# EAGLE design PhatStats Slim Enclosure ESP Lolin D32 XTP2046 PCB v1.0  (EAGLE 7.6.0)
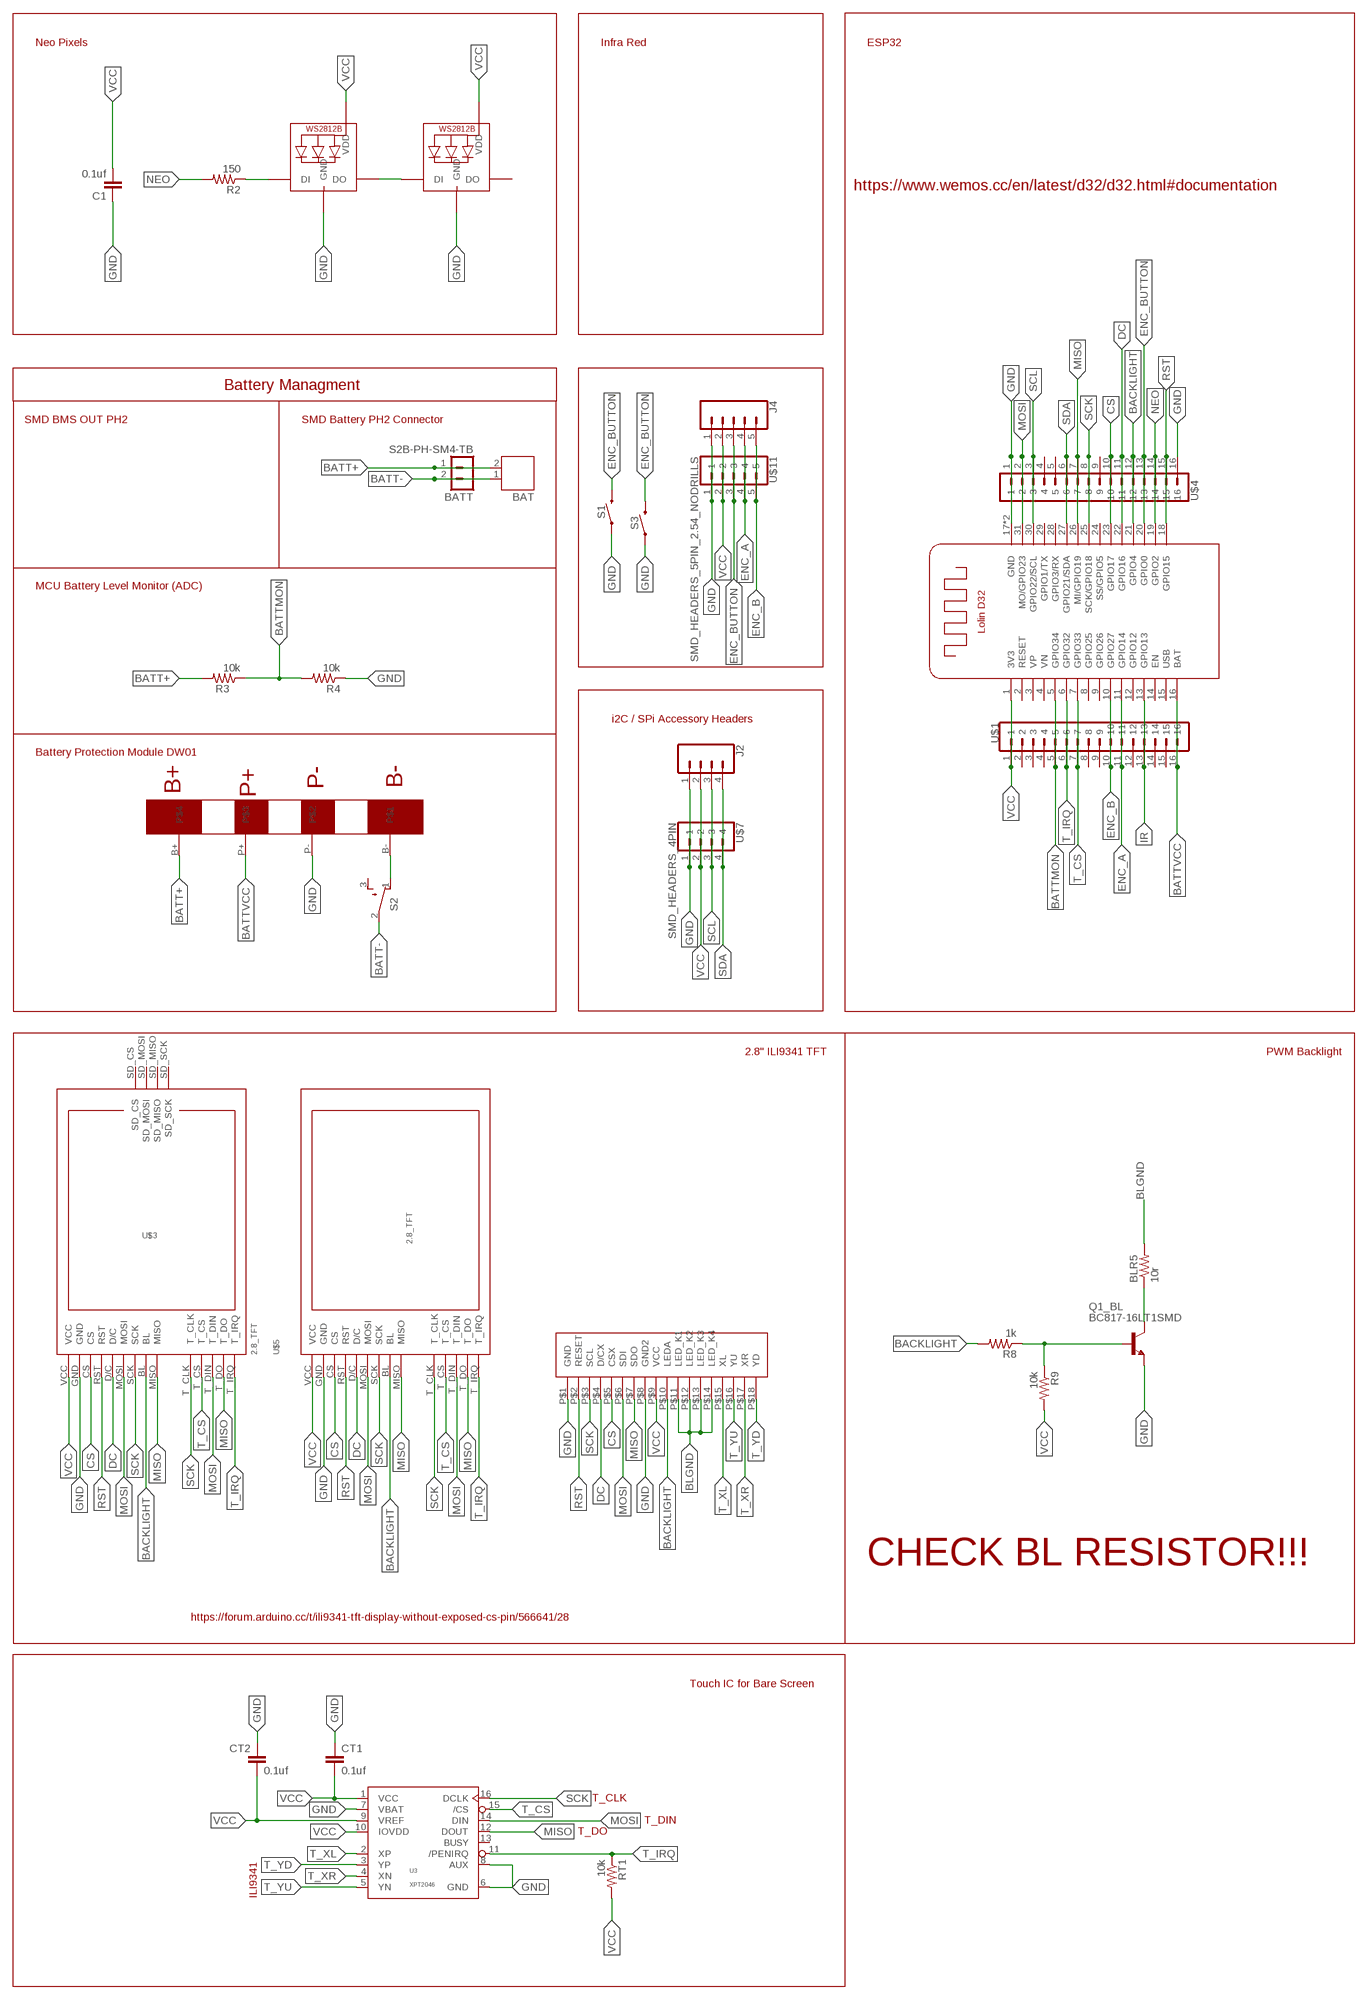
[diagram p0: schematic, sheet 1]

## Parts
0  ILI9341-2.8  [ILI9341-2.8]
BAT  JST-PH2  [JST-PH2]
BATT  S2B-PH-SM4-TB  [S2B-PH-SM4-TB]
BLR5  10r  R-US_M1206  [M1206]
BMS  DW01BATTERYPROT  [DW01BATTERYPROT]
C1  0.1uf  C-EUC1206  [C1206]
CT1  0.1uf  C-EUC1206  [C1206]
CT2  0.1uf  C-EUC1206  [C1206]
J2  CONN_04PTH  [1X04]
J4  CONN_05  [1X05]
NEO1  WS2812B5050  [WS2812B]
NEO2  WS2812B5050  [WS2812B]
Q1_BL  BC817-16LT1SMD  [SOT23-BEC]
R2  150  R-US_M1206  [M1206]
R3  10k  R-US_M1206  [M1206]
R4  10k  R-US_M1206  [M1206]
R8  1k  R-US_M1206  [M1206]
R9  10k  R-US_M1206  [M1206]
RT1  10k  R-US_M1206  [M1206]
S1  MOMENTARY-SWITCH-SPST-PTH-6.0MM  [TACTILE_SWITCH_PTH_6.0MM]
S2  SK-12F14(1P2T)0.5A50VDC3MMPITCH  [SK-12F14(1P2T)0.5A50VDC3MMPITCH]
S3  MOMENTARY-SWITCH-SPST-SMD-6.2MM-TALL  [TACTILE_SWITCH_SMD_6.2MM_TALL]
U3  XPT2046  [TSSOP-16]
U$1  SMD_HEADERS_16PIN_2.54_NODRILLSSMD_HEADERS_16PIN  [SMD_HEADERS_16PIN]
U$2  TML_LOLIND32  [TML_LOLIND32]
U$3  2.8_TFT  [2.8_TFT]
U$4  SMD_HEADERS_16PIN_2.54_NODRILLSSMD_HEADERS_16PIN  [SMD_HEADERS_16PIN]
U$5  2.8_TFT  [2.8_TFT]
U$7  SMD_HEADERS_4PIN  [SMD_HEADERS_4PIN]
U$11  SMD_HEADERS_5PIN_2.54_NODRILLS  [SMD_HEADERS_5PIN]

## Nets
BACKLIGHT: 0.P$10(LEDA) R8.2 U$2.21(GPIO4) U$3.BL U$4.12 U$5.BL
BATT+: BAT.2 BATT.1 BMS.B+ R3.2
BATT-: BAT.1 BATT.2 S2.2(P)
BATTMON: R3.1 R4.2 U$1.5 U$2.5(GPIO34)
BATTVCC: BMS.P+ U$1.16 U$2.16(BAT)
BL: BLR5.1 Q1_BL.C
BLGND: 0.P$11(LED_K1) 0.P$12(LED_K2) 0.P$13(LED_K3) 0.P$14(LED_K4) BLR5.2
CS: 0.P$5(CSX) U$2.23(GPIO17) U$3.CS U$4.10 U$5.CS
DC: 0.P$4(D/CX) U$2.22(GPIO16) U$3.D/C U$4.11 U$5.D/C
ENC_A: J4.4 U$1.11 U$2.11(GPIO14) U$11.4
ENC_B: J4.5 U$1.10 U$2.10(GPIO27) U$11.5
ENC_BUTTON: J4.3 S1.3 S3.B2 U$2.20(GPIO0) U$4.13 U$11.3
GND: 0.P$1(GND) 0.P$8(GND2) BMS.P- C1.1 CT1.1 CT2.1 J2.1 J4.1 NEO1.3-GND(GND) NEO2.3-GND(GND) Q1_BL.E R4.1 S1.1 S3.A2 U3.6(GND) U3.7(VBAT) U3.8(AUX) U$2.17(GND) U$2.32(GND) U$3.GND U$4.1 U$4.16 U$5.GND U$7.1 U$11.1
IR: U$1.13 U$2.13(GPIO13)
MISO: 0.P$7(SDO) U3.12(DOUT) U$2.26(MI/GPIO19) U$3.MISO U$3.T_DO U$4.7 U$5.MISO U$5.T_DO
MOSI: 0.P$6(SDI) U3.14(DIN) U$2.31(MO/GPIO23) U$3.MOSI U$3.T_DIN U$4.2 U$5.MOSI U$5.T_DIN
N$1: BMS.B- S2.1(O)
N$2: NEO1.2-DOUT(DO) NEO2.4-DIN(DI)
N$4: NEO1.4-DIN(DI) R2.1
N$7: Q1_BL.B R8.1 R9.1
NEO: R2.2 U$2.19(GPIO2) U$4.14
RST: 0.P$2(RESET) U$2.18(GPIO15) U$3.RST U$4.15 U$5.RST
SCK: 0.P$3(SCL) U3.16(DCLK) U$2.25(SCK/GPIO18) U$3.SCK U$3.T_CLK U$4.8 U$5.SCK U$5.T_CLK
SCL: J2.3 U$2.30(GPIO22/SCL) U$4.3 U$7.3
SDA: J2.4 U$2.27(GPIO21/SDA) U$4.6 U$7.4
T_CS: U3.15(/CS) U$1.7 U$2.7(GPIO33) U$3.T_CS U$5.T_CS
T_IRQ: RT1.1 U3.11(/PENIRQ) U$1.6 U$2.6(GPIO32) U$3.T_IRQ U$5.T_IRQ
T_XL: 0.P$15(XL) U3.2(XP)
T_XR: 0.P$17(XR) U3.4(XN)
T_YD: 0.P$18(YD) U3.3(YP)
T_YU: 0.P$16(YU) U3.5(YN)
VCC: 0.P$9(VCC) C1.2 CT1.2 CT2.2 J2.2 J4.2 NEO1.1-VDD(VDD) NEO2.1-VDD(VDD) R9.2 RT1.2 U3.1(VCC) U3.9(VREF) U3.10(IOVDD) U$1.1 U$2.1(3V3) U$3.VCC U$5.VCC U$7.2 U$11.2
Unconnected: NEO2.2-DOUT(DO) S2.3(S) U3.13(BUSY) U$1.2 U$1.3 U$1.4 U$1.8 U$1.9 U$1.12 U$1.14 U$1.15 U$2.2(RESET) U$2.3(VP) U$2.4(VN) U$2.8(GPIO25) U$2.9(GPIO26) U$2.12(GPIO12) U$2.14(EN) U$2.24(SS/GPIO5) U$2.28(GPIO3/RX) U$2.29(GPIO1/TX) U$3.SD_CS U$3.SD_MISO U$3.SD_MOSI U$3.SD_SCK U$4.4 U$4.5 U$4.9

## Notes on the sheet
- Neo Pixels | Infra Red | ESP32
- https://www.wemos.cc/en/latest/d32/d32.html#documentation
- Battery Managment
- SMD BMS OUT PH2 | SMD Battery PH2 Connector
- MCU Battery Level Monitor (ADC)
- i2C / SPi Accessory Headers
- Battery Protection Module DW01
- 2.8" ILI9341 TFT | PWM Backlight
- CHECK BL RESISTOR!!!
- https://forum.arduino.cc/t/ili9341-tft-display-without-exposed-cs-pin/566641/28
- Touch IC for Bare Screen
- T_CLK
- T_DIN
- T_DO
- ILI9341

## Power pins joined to a net without a drawn wire
USB: U$2.15(USB)

## Library data of the parts
0 = TML_ili9341_0.8Pitch_Header:ILI9341-2.8
BAT = jst-ph:JST-PH2
BATT = con-JST PH:S2B-PH: JST PH series header 2.00mm pitch disconnectable crimp style connectors, horizontal (side entry type), 2 pins
BLR5 R2-R4 R8 R9 RT1 = resistor:R-US_: RESISTOR, American symbol
BMS = TML_DW01_BatteryProtectionModule2:DW01BATTERYPROT
C1 CT1 CT2 = rcl:C-EU: CAPACITOR, European symbol
J2 = SparkFun-Connectors:CONN_04: Multi connection point. Often used as Generic Header-pin footprint for 0.1 inch spaced/style header connections On any of the 0.1 inch spaced packages, you can populate with these: Break Away Headers - Straight <https://www.sparkfun.com/products/116> (PRT-00116) Break Away Male Headers - Right Angle <https://www.sparkfun.com/products/553> (PRT-00553) Female Headers <https://www.sparkfun.com/products/115> (PRT-00115) Break Away Headers - Machine Pin <https://www.sparkfun.com/products/117> (PRT-00117) Break Away Female Headers - Swiss Machine Pin <https://www.sparkfun.com/products/743> (PRT-00743) For SCREWTERMINALS and SPRING TERMINALS visit here: Screw Terimnals on SparkFun.com <https://www.sparkfun.com/search/results?term=Screw+Terminals> (5mm/3.5mm/2.54mm spacing) This device is also useful as a general connection point to wire up your design to another part of your project. Our various solder wires solder well into these plated through hole pads. Hook-Up Wire - Assortment (Stranded, 22 AWG) <https://www.sparkfun.com/products/11375> (PRT-11375) Hook-Up Wire - Assortment (Solid Core, 22 AWG) <https://www.sparkfun.com/products/11367> (PRT-11367) View the entire wire category on our website here <https://www.sparkfun.com/categories/141> Special notes: Molex polarized connector foot print use with SKU : PRT-08231 with associated crimp pins and housings. 1MM SMD Version SKU: PRT-10208; PROD_ID: CONN-09696
J4 = SparkFun-Connectors:CONN_05: Multi connection point. Often used as Generic Header-pin footprint for 0.1 inch spaced/style header connections On any of the 0.1 inch spaced packages, you can populate with these: Break Away Headers - Straight <https://www.sparkfun.com/products/116> (PRT-00116) Break Away Male Headers - Right Angle <https://www.sparkfun.com/products/553> (PRT-00553) Female Headers <https://www.sparkfun.com/products/115> (PRT-00115) Break Away Headers - Machine Pin <https://www.sparkfun.com/products/117> (PRT-00117) Break Away Female Headers - Swiss Machine Pin <https://www.sparkfun.com/products/743> (PRT-00743) For SCREWTERMINALS and SPRING TERMINALS visit here: Screw Terimnals on SparkFun.com <https://www.sparkfun.com/search/results?term=Screw+Terminals> (5mm/3.5mm/2.54mm spacing) This device is also useful as a general connection point to wire up your design to another part of your project. Our various solder wires solder well into these plated through hole pads. Hook-Up Wire - Assortment (Stranded, 22 AWG) <https://www.sparkfun.com/products/11375> (PRT-11375) Hook-Up Wire - Assortment (Solid Core, 22 AWG) <https://www.sparkfun.com/products/11367> (PRT-11367) View the entire wire category on our website here <https://www.sparkfun.com/categories/141> Special notes: Molex polarized connector foot print use with SKU : PRT-08231 with associated crimp pins and housings. 1MM SMD Version SKU: PRT-10208
NEO1 NEO2 = adafruit:WS2812B
Q1_BL = transistor-npn:BC817*: NPN Transistor
S1 = SparkFun-Switches:MOMENTARY-SWITCH-SPST: Momentary Switch (Pushbutton) - SPST Normally-open (NO) SPST momentary switches (buttons, pushbuttons). Variants PTH-12MM - 12mm square, through-hole Momentary Pushbutton Switch - 12mm Square <https://www.sparkfun.com/products/9190> (COM-09190) PTH-6.0MM, PTH-6.0MM-KIT - 6.0mm square, through-hole Mini Pushbutton Switch <https://www.sparkfun.com/products/97> (COM-00097) KIT package intended for soldering kit's - only one side of pads' copper is exposed. PTH-RIGHT-ANGLE-KIT - Right-angle, through-hole Right Angle Tactile Button <https://www.sparkfun.com/products/10791> - Used on SparkFun BigTime Watch Kit <https://www.sparkfun.com/products/11734> SMD-12MM - 12mm square, surface-mount Tactile Button - SMD (12mm) <https://www.sparkfun.com/products/12993> (COM-12993) Used on SparkFun PicoBoard <https://www.sparkfun.com/products/11888> SMD-4.5MM - 4.5mm Square Trackball Switch Used on SparkFun Blackberry Trackballer Breakout <https://www.sparkfun.com/products/13169> SMD-4.6MMX2.8MM - 4.60mm x 2.80mm, surface mount Used on SparkFun SAMD21 Mini Breakout <https://www.sparkfun.com/products/13664> SMD-5.2MM, SMD-5.2-REDUNDANT - 5.2mm square, surface-mount Mini Pushbutton Switch - SMD <https://www.sparkfun.com/products/8720> (COM-08720) Used on Arduino Pro Mini <https://www.sparkfun.com/products/11114> REDUNDANT package connects both switch circuits together SMD-6.0X3.5MM - 6.0 x 3.5mm, surface mount Momentary Reset Switch SMD <https://www.sparkfun.com/products/8229> (COM-08229) SMD-6.2MM-TALL - 6.2mm square, surface mount Tactile Button - SMD (6mm) <https://www.sparkfun.com/products/12992> Used on SparkFun Digital Sandbox <https://www.sparkfun.com/products/12651> SMD-RIGHT-ANGLE - Right-angle, surface mount Used on SparkFun Block for Intel® Edison - Arduino <https://www.sparkfun.com/products/13036>; PROD_ID: SWCH-08441; SF_SKU: COM-00097
S2 = TML_SK-12F14(1P2T)  90D 0.5a 50vdc 3mm pitch:SK-12F14(1P2T)0.5A50VDC3MMPITCH: SK-12F14(1P2T) 0.5a 50vdc 3mm pitch
S3 = SparkFun-Switches:MOMENTARY-SWITCH-SPST: Momentary Switch (Pushbutton) - SPST Normally-open (NO) SPST momentary switches (buttons, pushbuttons). Variants PTH-12MM - 12mm square, through-hole Momentary Pushbutton Switch - 12mm Square <https://www.sparkfun.com/products/9190> (COM-09190) PTH-6.0MM, PTH-6.0MM-KIT - 6.0mm square, through-hole Mini Pushbutton Switch <https://www.sparkfun.com/products/97> (COM-00097) KIT package intended for soldering kit's - only one side of pads' copper is exposed. PTH-RIGHT-ANGLE-KIT - Right-angle, through-hole Right Angle Tactile Button <https://www.sparkfun.com/products/10791> - Used on SparkFun BigTime Watch Kit <https://www.sparkfun.com/products/11734> SMD-12MM - 12mm square, surface-mount Tactile Button - SMD (12mm) <https://www.sparkfun.com/products/12993> (COM-12993) Used on SparkFun PicoBoard <https://www.sparkfun.com/products/11888> SMD-4.5MM - 4.5mm Square Trackball Switch Used on SparkFun Blackberry Trackballer Breakout <https://www.sparkfun.com/products/13169> SMD-4.6MMX2.8MM - 4.60mm x 2.80mm, surface mount Used on SparkFun SAMD21 Mini Breakout <https://www.sparkfun.com/products/13664> SMD-5.2MM, SMD-5.2-REDUNDANT - 5.2mm square, surface-mount Mini Pushbutton Switch - SMD <https://www.sparkfun.com/products/8720> (COM-08720) Used on Arduino Pro Mini <https://www.sparkfun.com/products/11114> REDUNDANT package connects both switch circuits together SMD-6.0X3.5MM - 6.0 x 3.5mm, surface mount Momentary Reset Switch SMD <https://www.sparkfun.com/products/8229> (COM-08229) SMD-6.2MM-TALL - 6.2mm square, surface mount Tactile Button - SMD (6mm) <https://www.sparkfun.com/products/12992> Used on SparkFun Digital Sandbox <https://www.sparkfun.com/products/12651> SMD-RIGHT-ANGLE - Right-angle, surface mount Used on SparkFun Block for Intel® Edison - Arduino <https://www.sparkfun.com/products/13036>; PROD_ID: SWCH-11966; SF_SKU: COM-12992
U3 = TML_XPT2046:XPT2046: XPT2046 touch screen controller General Description The XPT2046 is a 4-wire resistive touch screen controller that incorporates a 12-bit 125 kHz sampling SAR type A/D converter. The XPT2046 operates down to 2.2V supply voltage and supports digital I/O interface voltage from 1.5V to VCC in order to connect low voltage uP. The XPT2046 can detect the pressed screen location by performing two A/D conversions. In addition to location, the XPT2046 also measures touch screen pressure.On-chip VREF can be utilized for analog auxiliary input, temperature measurement and battery monitoring withthe ability to measure voltage from 0V to 5V. The XPT2046 also has an on-chip temperature sensor The XPT2046 is available in 16pin QFN thin package(0.75mm in height) and has the operating temperature range of -40°C to +85°C Features 12 bit SAR type A/D converter with S/H circuit Low voltage operation (VCC = 2.2V ∼ 3.6V) Low voltage digital I/F (1.5V ∼ VCC) 4-wire I/F Sampling frequency: 125 kHz (max) On-Chip voltage reference (2.5V) Pen pressure measurement On-chip thermo sensor Direct battery masurement Low power consumption (260μA) Package 16pin QFN Check prices <https://pricing.snapeda.com/parts/XPT2046/Xptek/view-part?ref=eda>; AVAILABILITY: Not in stock; DESCRIPTION: RASPBERRY PI 3.5 TFT DISPLAY; MF: Xptek; MP: XPT2046; PACKAGE: Package; PRICE: None
U$1 U$4 = TML_SMD_Headers_2.54_NoDrill:SMD_HEADERS_16PIN_2.54_NODRILLS
U$2 = TML_Wemos Lolin D32 ESP32 Round Corrected:TML_LOLIND32: Wemos Lolin D32 Lolin D32 is a development board based on ESP32. On this schematic, this board is designed with battery port. Pins VP and VN are Not Connected pins.
U$3 = TML_ili9341-2.8_tft-display_Corrected:2.8_TFT: ILI9341 2.8" 2.8 inch TFT SPI Touch Panel 240X320 http://www.lcdwiki.com/2.8inch_SPI_Module_ILI9341_SKU:MSP2807 http://www.lcdwiki.com/Run_Arduino_Demo_in_spi_model
U$5 = TML_ili9341-2.8_tft-display_PinHeader only:2.8_TFT: ILI9341 2.8" 2.8 inch TFT SPI Touch Panel 240X320 http://www.lcdwiki.com/2.8inch_SPI_Module_ILI9341_SKU:MSP2807 http://www.lcdwiki.com/Run_Arduino_Demo_in_spi_model
U$7 = TML_SMD_Headers_2.54_NoDrill:SMD_HEADERS_4PIN
U$11 = TML_SMD_Headers_2.54_NoDrill:SMD_HEADERS_5PIN_2.54_NODRILLS

## Board
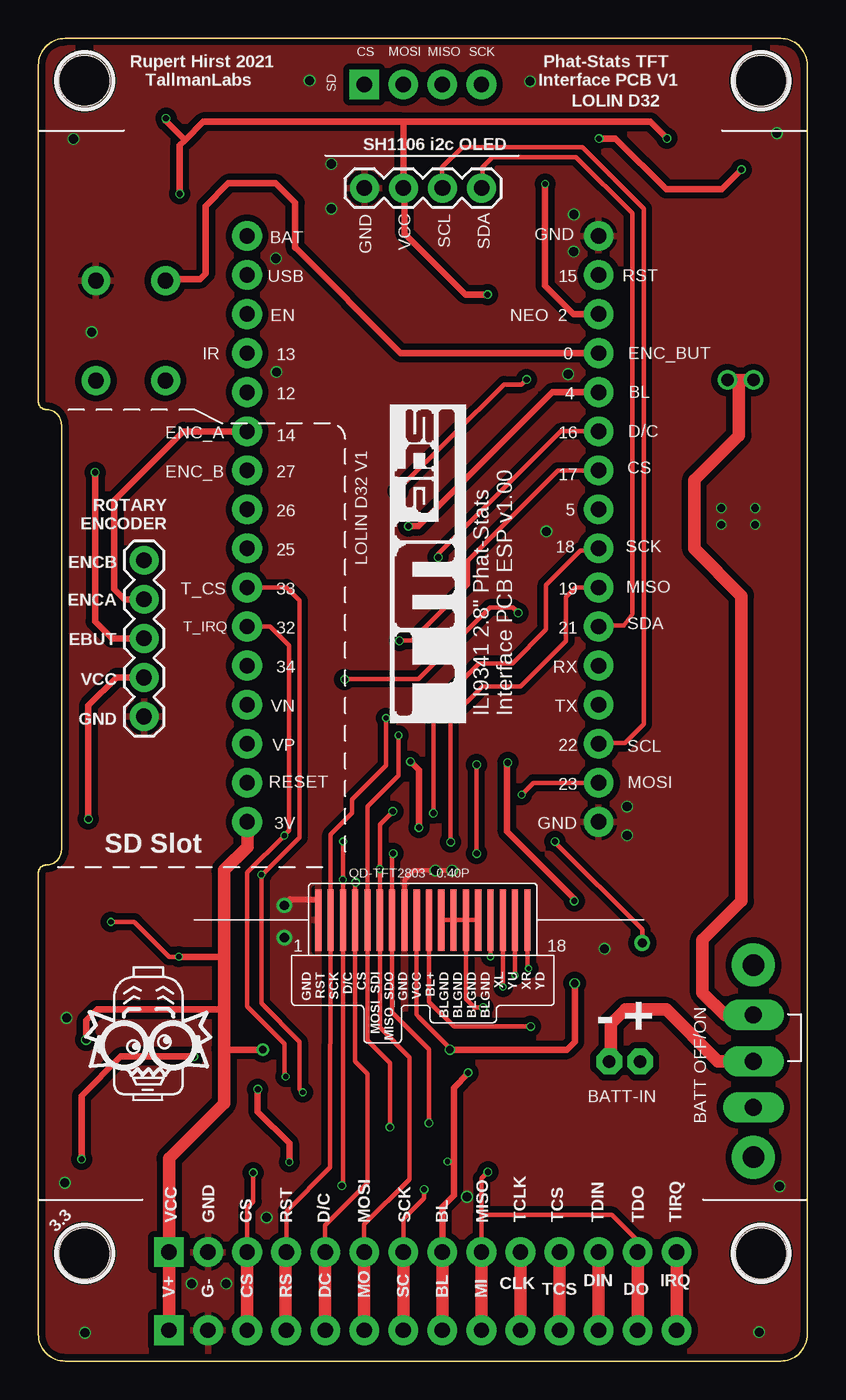
[diagram p1: board, top side]
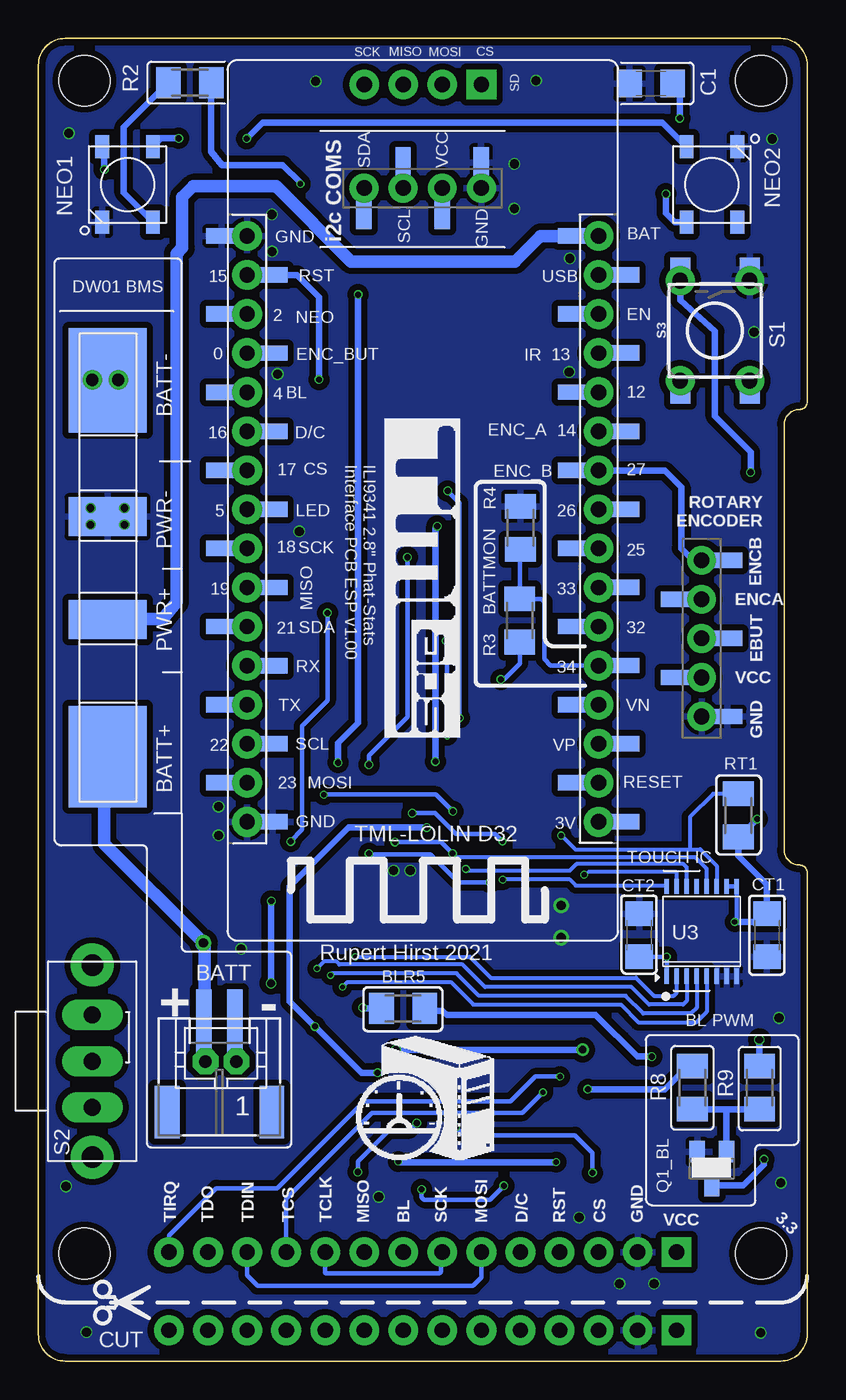
[diagram p2: board, bottom side, seen from below]

Size 50 x 86 mm. Coordinates in mm from the lower left corner, seen from the top.
Outline: 50,84.27 50,1.73 arc-90 48.27,0 1.73,0 arc-90 0,1.73 0,31.75 arc-90 0.5,32.25 arc90 1.5,33.25 1.5,60.88 arc90 0.5,61.88 arc-90 0,62.38 0,84.27 arc-90 1.73,86 48.27,86 arc-90 50,84.27
Copper layers (1*16): Top 0.035mm / dielectric 1.6mm / Bottom 0.035mm
Design rules "jlcpcb-2layers": minimum track width 5mil, minimum drill 0.3mm, track to track 5mil, track to pad 5mil, pad to pad 5mil, via to via 5mil, smd to smd 5mil, copper to edge 0.2mm, drill to drill 6mil, minimum pad ring 10mil, minimum via ring 3mil, stop-mask expansion 4mil, vias tented up to drill 0mil, thermal gap 10mil
Holes 3.3 mm at 3,83.25 47,83.25 47,7 3,7

### Footprints (pad centres in the part's own frame; a part is rotated, then mirrored left to right if it is on the bottom)
ILI9341-2.8 = smd 4 x 0.4: P$1 -18,6.8; P$2 -18,6; P$3 -18,5.2; P$4 -18,4.4; P$5 -18,3.6; P$6 -18,2.8; P$7 -18,2; P$8 -18,1.2; P$9 -18,0.4; P$10 -18,-0.4; P$11 -18,-1.2; P$12 -18,-2; P$13 -18,-2.8; P$14 -18,-3.6; P$15 -18,-4.4; P$16 -18,-5.2; P$17 -18,-6; P$18 -18,-6.8
JST-PH2 = drill 0.813 pad 1.676 octagon: 1 1,0; 2 -1,0
S2B-PH-SM4-TB = smd 1 x 4.5: 1 1,0; 2 -1,0 | smd 1.6 x 3.4: M1 3.4,5.75; M2 -3.4,5.75
M1206 = smd 1.6 x 2: 1 -1.4,0; 2 1.4,0
DW01BATTERYPROT = smd 5.08 x 2.54: B+ 3.175,29.15; B+1 3.175,26.745; B+2 3.175,6.405; B+3 3.175,30.805; B- 3.175,4.31; B-1 3.175,2.155; P+ 3.175,19.839; P- 3.175,13.154
C1206 = smd 1.6 x 1.8: 1 -1.4,0; 2 1.4,0
1X04 = drill 1.016 pad 1.88: 1 0,0; 2 2.54,0; 3 5.08,0; 4 7.62,0
1X05 = drill 1.016 pad 1.88: 1 0,0; 2 2.54,0; 3 5.08,0; 4 7.62,0; 5 10.16,0
WS2812B = smd 1.5 x 0.9: 1-VDD 2.45,-1.65; 2-DOUT 2.45,1.65; 3-GND -2.45,1.65; 4-DIN -2.45,-1.65
SOT23-BEC = smd 1 x 1.4: B -0.95,-1.1; C 0,1.1; E 0.95,-1.1
TACTILE_SWITCH_PTH_6.0MM = drill 1.016 pad 1.88: 1 -3.251,2.261; 2 3.251,2.261; 3 -3.251,-2.261; 4 3.251,-2.261
SK-12F14(1P2T)0.5A50VDC3MMPITCH = drill 1.1 pad 1.422 long: 1 -3,0; 2 0,0; 3 3,0 | drill 1.4 pad 2.8: M1 -6.25,0; M2 6.25,0
TACTILE_SWITCH_SMD_6.2MM_TALL = smd 1.55 x 1.3: A1 -3.975,-2.25; A2 3.975,-2.25; B1 -3.975,2.25; B2 3.975,2.25
TSSOP-16 = smd 0.305 x 0.991: 1 -2.275,-2.918; 2 -1.625,-2.918; 3 -0.975,-2.918; 4 -0.325,-2.918; 5 0.325,-2.918; 6 0.975,-2.918; 7 1.625,-2.918; 8 2.275,-2.918; 9 2.275,2.918; 10 1.625,2.918; 11 0.975,2.918; 12 0.325,2.918; 13 -0.325,2.918; 14 -0.975,2.918; 15 -1.625,2.918; 16 -2.275,2.918
SMD_HEADERS_16PIN = smd 1 x 2: 1 1.27,-0.38; 2 3.81,2.92; 3 6.35,-0.38; 4 8.89,2.92; 5 11.43,-0.38; 6 13.97,2.92; 7 16.51,-0.38; 8 19.05,2.92; 9 21.59,-0.38; 10 24.13,2.92; 11 26.67,-0.38; 12 29.21,2.92; 13 31.75,-0.38; 14 34.29,2.92; 15 36.83,-0.38; 16 39.37,2.92
TML_LOLIND32 = drill 1 pad 1.93: 1 -11.43,20.955; 2 -11.43,18.415; 3 -11.43,15.875; 4 -11.43,13.335; 5 -11.43,10.795; 6 -11.43,8.255; 7 -11.43,5.715; 8 -11.43,3.175; 9 -11.43,0.635; 10 -11.43,-1.905; 11 -11.43,-4.445; 12 -11.43,-6.985; 13 -11.43,-9.525; 14 -11.43,-12.065; 15 -11.43,-14.605; 16 -11.43,-17.145; 17 11.43,-17.145; 18 11.43,-14.605; 19 11.43,-12.065; 20 11.43,-9.525; 21 11.43,-6.985; 22 11.43,-4.445; 23 11.43,-1.905; 24 11.43,0.635; 25 11.43,3.175; 26 11.43,5.715; 27 11.43,8.255; 28 11.43,10.795; 29 11.43,13.335; 30 11.43,15.875; 31 11.43,18.415; 32 11.43,20.955
2.8_TFT = drill 1 pad 1.93: BL 26.27,2; CS 13.57,2; D/C 18.65,2; GND 11.03,2; MISO 28.81,2; MOSI 21.19,2; RST 16.11,2; SCK 23.73,2; SD_MISO 26.27,83; SD_MOSI 23.73,83; SD_SCK 28.81,83; T_CLK 31.35,2; T_CS 33.89,2; T_DIN 36.43,2; T_DO 38.97,2; T_IRQ 41.51,2 | drill 1 pad 1.93 square: SD_CS 21.19,83; VCC 8.49,2
2.8_TFT' = drill 1 pad 1.93: BL 26.27,2; CS 13.57,2; D/C 18.65,2; GND 11.03,2; MISO 28.81,2; MOSI 21.19,2; RST 16.11,2; SCK 23.73,2; T_CLK 31.35,2; T_CS 33.89,2; T_DIN 36.43,2; T_DO 38.97,2; T_IRQ 41.51,2 | drill 1 pad 1.93 square: VCC 8.49,2
SMD_HEADERS_4PIN = smd 1 x 2: 1 1.27,-0.38; 2 3.81,2.92; 3 6.35,-0.38; 4 8.89,2.92
SMD_HEADERS_5PIN = smd 1 x 2: 1 1.27,-0.38; 2 3.81,2.92; 3 6.35,-0.38; 4 8.89,2.92; 5 11.43,-0.38

### Placement (x,y rotation side)
0  25,46.68 90 top
BAT  38.13,19.48 0 bottom
BATT  38.23,21.93 180 bottom
BLR5  26.28,22.92 180 bottom
BMS  42.33,68.06 180 bottom
C1  10.16,83.07 0 bottom
CT1  2.62,27.69 90 bottom
CT2  10.93,27.69 270 bottom
J2  21.2,76.27 0 top
J4  6.87,41.91 90 top
NEO1  44.2,76.5 90 bottom
NEO2  6.2,76.5 270 bottom
Q1_BL  6.21,12.51 180 bottom
R2  40.16,83.12 0 bottom
R3  18.7,48.16 270 bottom
R4  18.66,54.17 270 bottom
R8  7.47,17.78 90 bottom
R9  3.1,17.78 90 bottom
RT1  4.47,35.48 270 bottom
S1  6,67 270 bottom
S2  46.5,19.5 270 bottom
S3  6,67 90 bottom
U3  6.86,27.94 0 bottom
U$1  12.3,33.79 90 bottom
U$2  25,56.02 180 bottom
U$3  0,0 0 top
U$4  35.16,33.79 90 bottom
U$5  2.8_TFT  [2.8_TFT']  0,5.08 0 top
U$6  [MADPROF]  4.88,16.68 0 top
U$7  19.94,77.53 180 bottom
U$8  [HSMSMALL]  29.11,12.17 0 bottom
U$9  [TMSLOGO_INVERTED]  28.85,61.91 270 bottom
U$10  [TMSLOGO_INVERTED]  29.14,40.84 90 top
U$11  5.59,40.64 90 bottom
U$13  [SCISSORS_TS]  46.99,5.08 0 bottom

### Tracks (layer width: path | path; a pad name or v marks a point on that pad's centre or on a via)
BACKLIGHT  (via drill 0.35, 0.4)
  Top 0.305: 0.P$10 25.4,23.37 27.01,21.75 v32.01,21.75
  Top 0.406: v24.75,34.69 24.75,38.42 v24.19,38.98 | v24.07,54.29 24.71,54.29 33.41,63 U$2.21 | v14.27,17.67 14.27,16.21 16.32,14.16 v16.32,12.93 | U$5.BL 26.27,10.04 27.02,10.79 27.02,12.94 | 27.02,12.94 27.02,17.78 27.94,18.69 v27.94,18.75 | v26.6,12.96 27,12.96 27.02,12.94
  Top 0.813: U$3.BL U$5.BL
  Bottom 0.305: 24.19,54.17 v24.07,54.29 | v32.01,21.75 32.04,21.75
  Bottom 0.406: v24.75,34.69 29.83,34.69 33.66,30.85 33.66,23.38 32.04,21.75 | v24.19,38.98 24.19,54.17 | R8.2 7.74,19.18 9.25,17.67 v14.27,17.67 | U$4.12 U$2.21 U$4.12 | v32.01,21.75 31.95,21.7 28.99,18.75 v27.94,18.75 | v16.32,12.93 26.43,12.93 26.46,12.96 v26.6,12.96 | v27.94,18.75
BATT+  (via drill 0.4, 0.6 pad 1.02)
  Top 0.305: v39.27,27.18 39.27,28.06 33.6,33.73 v33.6,33.78 | v31.2,48.65 30.87,48.98 29.35,48.98 24.71,44.34 19.94,44.34 v19.92,44.32
  Bottom 0.305: v33.6,33.78 33.6,33.8 32.84,34.56 32.84,41.3 31.2,42.94 v31.2,48.65 | v19.92,44.32 19.74,44.32 18.7,45.37 R3.2
  Bottom 0.406: 18.38,46.7 R3.2
  Bottom 0.813: BAT.2 39.13,21.83 BATT.1 39.19,21.98 39.19,27.19 39.27,27.1 39.38,27.1 v39.27,27.18 45.72,33.63 45.72,38.69 BMS.B+
BATT-
  Top 0.813: S2.2 44.19,19.5 40.83,22.86 38.16,22.86 BATT.2 37.23,19.58 BAT.1
  Bottom 0.813: BATT.2 37.23,19.58 BAT.1
BATTMON
  Bottom 0.305: 18.38,52.69 18.37,52.68 R4.2 18.7,52.44 R3.1 17.3,49.56 17.1,49.36 17.1,45.64 16.69,45.22 U$2.5
  Bottom 0.406: U$2.5 U$1.5
BATTVCC
  Bottom 0.406: U$2.16 U$1.16
  Bottom 0.813: U$2.16 17.34,73.16 19,71.5 29.66,71.5 34.55,76.39 39.93,76.39 40.64,75.68 40.64,72.39 41.02,72.02 41.02,49.34 41.91,48.26 45.46,48.26 BMS.P+
BL  (via drill 0.4)
  Top 0.406: v10.1,19.8 5.36,19.8 2.81,17.25 v2.81,13.12
  Bottom 0.406: Q1_BL.C 4.15,11.41 2.81,12.75 v2.81,13.12 | v10.1,19.8 11.06,19.8 13.77,22.51 23.44,22.51 23.71,22.77 24.88,22.77 BLR5.1
BLGND  (via drill 0.4)
  Top 0.305: 0.P$14 0.P$13 | 0.P$13 0.P$12 0.P$11 | 0.P$13 27.8,23.53 28.35,22.98 v28.91,22.98
  Top 0.406: 0.P$13 27.77,28.65
  Bottom 0.406: v28.91,22.98 28.91,22.93 28.28,22.93 28.28,22.92 BLR5.2
CS  (via drill 0.35, 0.4)
  Top 0.305: v22.86,15.2 22.86,19.38 21.4,20.84 0.P$5 21.41,35.38 21.41,36.06 23.42,38.08 v23.42,40.68 | U$5.CS 13.57,9.96 13.97,10.37 v13.97,12.24 | U$2.23 36.41,57.9 36.35,57.9 33.77,57.9 27.94,52.07 27.94,50.48 24.3,46.84 v23.48,46.84
  Top 0.813: U$3.CS U$5.CS
  Bottom 0.305: v22.86,15.2 22.34,14.68 15.1,14.68 13.97,13.55 v13.97,12.24 | v23.48,46.84 23.42,46.78 v23.42,40.68
  Bottom 0.406: U$4.10 U$2.23 U$4.10
DC  (via drill 0.4)
  Top 0.305: U$5.D/C 18.65,8.82 21.4,11.57 21.4,18.68 20.6,19.48 0.P$4 20.6,31.1 v20.62,31.12 | v28.5,33 v28.5,38.77 | v26,52.27 26,52.48 33.98,60.46 U$2.22
  Top 0.813: U$3.D/C U$5.D/C
  Bottom 0.305: v26,52.27 26,41.87 28.5,39.37 v28.5,38.77 | v20.62,31.12 22.69,31.12 24.49,32.93 28.43,32.93 v28.5,33
  Bottom 0.406: U$4.11 U$2.22
ENC_A
  Top 0.406: J4.4 5.61,49.53 4.94,50.2 4.94,55.96 9.41,60.44 13.55,60.44 U$2.11
  Bottom 0.406: U$2.11 U$1.11 | J4.4 U$11.4
ENC_B
  Bottom 0.406: U$2.10 13.37,57.9 9.27,57.9 8.19,56.82 8.19,52.83 7.43,52.07 J4.5 U$11.5 | U$2.10 | U$2.10 U$1.10
ENC_BUTTON  (via drill 0.4)
  Top 0.406: J4.3 4.79,46.99 3.68,48.1 v3.68,57.78 | U$2.20 23.56,65.54 16.71,72.39 16.7,72.39 16.7,75.31 15.43,76.58 12.34,76.58 10.88,75.11 10.88,70.71 10.52,70.35 8.16,70.35 | 8.12,70.35 8.16,70.35 | 8.16,70.35 S1.3
  Bottom 0.406: v3.68,57.78 3.68,59.11 6,61.43 6,66.96 8.26,68.98 S1.3 | 8.06,70.29 S1.3 | S1.3 8.09,71 S3.B2 | U$4.13 U$2.20 | J4.3 U$11.3
GND  (via drill 0.5, 0.6, 0.6 pad 1)
  Top 0.305: 0.P$8 23.8,31.3 24.39,31.89 v25.82,31.89 v26.9,31.89
  Top 0.406: 0.P$1 18.21,30 16.38,30 v16,29.62
  Bottom 0.406: U$2.32 U$4.1 | U$2.17 U$4.16
  Bottom 0.813: 45.34,54.91 BMS.P- 45.72,54.68 45.72,54.61 45.5,54.83 BMS.P- | U$4.1 | v46.62,55.46 v46.62,54.38 | v44.41,55.46 v44.41,54.38
  other vias: 46.88,1.88 1.71,11.59 3.02,1.84 12.21,5.03 3.46,66.9 48.02,79.84 2.27,79.47 14.84,9.34 9.96,5.03 1.83,22.32 31.97,83.22 36.81,26.81 48.2,11.36 38.28,34.18 27.87,10.68 33.04,53.94 34.45,64.17 17.64,83.26 15.48,64.31 15.44,71.7 19.05,74.93 34.8,72.14 34.83,74.56 38.28,36.05 19.05,77.84 16,27.53
  pour Bottom (isolate 0.406): -1.27,-1.27 -1.27,87.63 50.8,87.63 50.8,-1.27
  pour Top (isolate 0.406): -2.54,-2.54 -2.54,88.9 52.07,88.9 52.07,-2.54
IR
  Bottom 0.406: U$2.13 U$1.13
MISO  (via drill 0.4)
  Top 0.305: v25.4,15.47 25.4,20.28 23,22.68 0.P$7 23,32.94 v23.06,33 | v26.81,33.75 26.81,41.81 28.88,43.88 31.36,43.88 34.31,46.83 34.31,49.69 34.92,50.3 U$2.26 | v29.23,12.29 28.81,11.87 28.81,9.5 | 28.81,9.5 37.3,9.5 38.97,7.83 U$5.T_DO | U$5.MISO 28.81,9.5
  Top 0.813: U$3.MISO U$5.MISO | U$3.T_DO U$5.T_DO
  Bottom 0.254: U3.12 6.54,32 7.3,32.77 22.83,32.77 v23.06,33 23.05,33.01
  Bottom 0.305: v29.23,12.29 29.23,13 27.21,15.02 25.85,15.02 v25.4,15.47 | v26.81,33.75 23.81,33.75 v23.06,33 | U$2.26 35.56,50.3 U$4.7
  Bottom 0.406: U$4.7 35.56,50.3
MOSI  (via drill 0.35, 0.4)
  Top 0.305: 0.P$6 22.2,21.69 24.13,19.76 24.13,11.82 21.19,8.88 21.19,7.26 U$5.MOSI | 0.P$6 v22.2,32 22.2,34.69 22.2,34.9 v23.05,35.75 | 0.P$6 | v31.44,36.83 32.21,37.6 U$2.31 36.33,37.7
  Top 0.813: U$3.MOSI U$5.MOSI | U$5.T_DIN U$3.T_DIN
  Bottom 0.254: v22.2,32 22.08,31.88 15.45,31.88 15.01,32.32 8.05,32.32 7.84,32.1 U3.14
  Bottom 0.305: v23.05,35.75 24.13,36.83 v31.44,36.83 | U$5.T_DIN 36.43,5.58 35.75,4.89 21.73,4.89 21.19,5.44 U$5.MOSI
  Bottom 0.406: U$4.2 U$2.31 U$4.2
N$1  (via drill 0.8 pad 1.27)
  Top 0.813: S2.1 44.62,22.5 43.18,23.95 43.18,27.38 45.72,29.92 45.72,49.76 42.66,52.82 42.66,57.28 45.56,60.19 45.56,63.79 | v46.5,63.79 45.56,63.79 | 45.56,63.79 v44.81,63.79
  Bottom 0.813: v44.81,63.79 45.17,63.65 45.43,63.6 BMS.B-
N$2  (via drill 0.4)
  Top 0.406: v45.72,77.47 44.45,76.2 40.83,76.2 37.54,79.49 v36.46,79.49
  Bottom 0.406: NEO1.2-DOUT 45.72,78.97 v45.72,77.47 | NEO2.4-DIN 9.42,80.52 35.43,80.52 v36.46,79.49
N$4
  Bottom 0.406: NEO1.4-DIN 44.45,75.98 44.45,80.22 R2.1
N$7
  Bottom 0.406: R9.1 5.27,16.38 | 5.27,16.38 R8.1 | 5.27,16.38 5.27,13.62 Q1_BL.B
NEO  (via drill 0.35)
  Top 0.406: v32.96,76.54 32.96,69.91 34.79,68.08 U$2.19
  Bottom 0.406: R2.2 38.76,78.65 38.06,77.77 34.12,77.77 32.96,76.61 v32.96,76.54 | U$2.19 U$4.14
RST  (via drill 0.35, 0.4)
  Top 0.254: 16.11,2.02 16.09,2
  Top 0.305: U$3.RST 16.09,2 | 16.14,7.25 16.12,7.12 U$5.RST 16.12,7.47 16.12,9.75 18.98,12.6 0.P$2 19,34.24 20.38,35.62 20.38,36.51 22.6,38.73 v22.6,41.81 | v23.38,56.58 23.36,56.61 23.46,56.73 30.29,63.5 31.43,63.5 v31.75,63.82
  Top 0.813: 16.09,2 16.09,7.06 U$5.RST
  Bottom 0.305: v23.38,56.58 22.6,55.8 v22.6,41.81
  Bottom 0.406: v31.75,63.82 31.75,69.19 33.18,70.62 34.29,70.62 | 34.29,70.62 U$4.15 | U$4.15 U$2.18 | 34.29,70.62 | U$4.15
SCK  (via drill 0.35, 0.4)
  Top 0.305: U$5.SCK 23.73,9.24 25.09,10.59 v25.09,11.16 | v25.69,35.62 25.69,42.38 28.65,45.34 30.81,45.34 33.02,47.55 33.02,50.47 35.24,52.69 36.19,52.69 36.38,52.88 36.4,52.88 U$2.25 | v19.82,33.78 19.8,33.77 v19.8,31.3 0.P$3 19.8,11.46 v19.73,11.39
  Top 0.813: U$3.T_CLK U$5.T_CLK | U$3.SCK U$5.SCK
  Bottom 0.254: U3.16 9.2,30.92 15.05,30.92 15.43,31.3 v19.8,31.3
  Bottom 0.305: 25.02,11.11 v25.09,11.16 25.09,10.66 24.92,10.49 20.63,10.49 v19.73,11.39 | U$5.SCK 23.81,7 23.81,5.81 23.93,5.7 31.31,5.7 31.35,5.74 U$5.T_CLK | v19.82,33.78 v19.82,33.79 20.32,34.29 22.86,34.29 24.2,35.62 v25.69,35.62
  Bottom 0.406: U$4.8 U$2.25 36.38,52.84 36.38,52.88 38.08,52.88 U$4.8
SCL
  Top 0.305: U$2.30 36.47,40.18 38.13,40.18 39.38,41.43 39.38,74.92 35.36,78.94 27.57,78.94 26.25,77.61 26.25,76.3 J2.3
  Bottom 0.406: U$2.30 35.56,40.14 | 35.56,40.14 U$4.3 | U$4.3 35.56,40.14 | U$7.3 26.29,76.28 J2.3
SDA
  Top 0.305: U$2.27 36.38,47.81 38.06,47.81 38.62,48.56 38.62,74.62 34.96,78.29 29.54,78.29 28.88,77.62 28.88,76.33 J2.4
  Bottom 0.406: U$4.6 U$2.27 | U$7.4 J2.4
T_CS  (via drill 0.35)
  Top 0.305: v17.19,17.47 16.98,17.68 16.98,20.77 14.5,23.25 v14.5,31.62 14.5,31.56 16.98,34.04 16.98,49.44 16.12,50.3 U$2.7
  Top 0.813: U$3.T_CS U$5.T_CS
  Bottom 0.254: U3.15 8.49,31.73 8.57,31.81 14.18,31.81 v14.5,31.62
  Bottom 0.305: U$5.T_CS 33.89,10.56 28.31,16.14 18.52,16.14 v17.19,17.47
  Bottom 0.406: U$2.7 U$1.7
T_IRQ  (via drill 0.35)
  Top 0.305: U$2.6 15.07,47.76 16.3,46.53 16.3,34.5 v15.99,34.17 13.59,31.76 13.59,23.06 16.02,20.62 16.02,18.57 v16.08,18.5
  Top 0.813: U$3.T_IRQ U$5.T_IRQ
  Bottom 0.254: 7.62,33.27 15.1,33.27 15.11,33.28 v15.99,34.17 | 7.62,33.27 6.95,33.27 5.89,32.21 U3.11 | RT1.1 6.11,36.88 7.62,35.37 7.62,33.27
  Bottom 0.305: U$5.T_IRQ 41.51,8.16 38.43,11.24 34.48,11.24 28.84,16.89 19.3,16.89 17.69,18.5 v16.08,18.5 | U$2.6
  Bottom 0.406: U$1.6 U$2.6
T_XL  (via drill 0.3)
  Top 0.305: 29.44,28.64 0.P$15 v29.4,26.29
  Bottom 0.254: U3.2 8.49,23.94 8.68,23.75 9.97,23.75 11.13,24.91 20.57,24.91 21.94,26.29 v29.4,26.29
T_XR  (via drill 0.3)
  Top 0.305: 0.P$17 v31,25.08
  Bottom 0.254: U3.4 7.19,22.98 7.56,22.61 10.67,22.61 11.81,23.75 21.34,23.75 22.8,25.21 30.87,25.21 v31,25.08
  Bottom 0.305: v31,25.08 30.89,25.2
T_YD  (via drill 0.3)
  Top 0.305: v31.88,25.53 31.81,25.59 31.81,27.62 31.75,27.69 31.75,28.63 0.P$18
  Bottom 0.254: U3.3 7.84,23.41 8.06,23.18 10.29,23.18 11.43,24.32 20.95,24.32 22.42,25.78 30.42,25.78 30.61,25.97 31.43,25.97 v31.88,25.53
  Bottom 0.305: v31.88,25.53 31.82,25.53
T_YU  (via drill 0.3)
  Top 0.305: 30.19,28.67 0.P$16 30.2,24.34 v30.22,24.32
  Bottom 0.254: U3.5 6.54,22.7 7.21,22.04 10.99,22.04 12.13,23.18 21.72,23.18 23.18,24.64 29.91,24.64 v30.22,24.32
VCC  (via drill 0.35, 0.4, 0.5, 0.5 pad 0.8)
  Top 0.305: 0.P$9 24.6,22.54 24.73,22.38 26.85,20.25 v26.75,20.24 | v9.19,75.89 v9.2,75.89 | v9.14,26.29 8.5,26.29 6.24,28.55 v4.71,28.55
  Top 0.406: v30.52,38.91 30.48,38.87 30.48,34.44 34.85,30.06 v34.85,29.92 | v29.21,69.34 27.78,69.34 23.81,73.31 23.81,76.27 J2.2 23.74,80.46 23.62,80.57 | 23.62,80.57 39.8,80.57 v40.88,79.5 | v9.2,75.89 9.2,79.05 9.53,79.38 | 9.53,79.38 10.72,80.57 23.62,80.57 | v8.29,80.81 8.29,80.61 9.53,79.38 | J4.2 5.08,44.45 3.25,42.62 v3.25,35.24 | 13.31,35.06 | v34.88,24.56 34.88,20.75 34.37,20.24 v26.75,20.24 | v14.6,20.24 12.15,20.24 12.07,20.32 | v9.14,26.29 12,26.29 12.06,26.23 12.06,22.99 12.07,22.98 11.96,22.86 3.81,22.86 3.11,22.16 v3.11,20.89
  Top 0.813: 13.31,35.06 U$2.1 13.6,34.33 13.6,33.44 12.07,31.92 12.07,22.98 12.07,20.32 12.07,16.76 8.49,13.18 U$5.VCC U$3.VCC
  Bottom 0.305: U3.1 v9.14,26.29 CT2.2 | U3.10 U3.9 4.59,28.68 v4.71,28.55
  Bottom 0.406: v9.19,75.89 9.19,74.62 8.61,74.05 NEO2.1-VDD | v40.88,79.5 42.01,79.5 NEO1.1-VDD | v30.52,38.91 30.52,40.18 29.21,41.49 v29.21,69.34 | v34.88,24.56 34.88,29.71 v34.85,29.92 | v8.29,80.81 8.29,82.6 C1.2 | U$1.1 U$2.1 | v4.71,28.55 2.75,28.55 2.53,28.77 2.53,29 CT1.2 2.62,31 4.47,32.86 RT1.2 4.41,34.08 v3.25,35.24 | v14.6,20.24 26.63,20.24 v26.75,20.24 | R9.2 v3.1,20.88 v3.11,20.89 | U$7.2 J2.2 | J4.2 U$11.2
  Bottom 0.61: 8.44,7.5 8.49,7.12 U$5.VCC
  Bottom 0.813: U$2.1

### Text on the board
tPlace: Rupert Hirst 2021 / TallmanLabs | Phat-Stats TFT / Interface PCB V1 | LOLIN D32 | SH1106 i2c OLED | GND | VCC | SCL | SDA | BAT | GND | USB | 15 | RST | EN | NEO | 2 | 13 | 0 | IR | ENC_BUT | 12 | 4 | BL | ENC_A | 14 | 16 | D/C | LOLIN D32 V1 | ENC_B | 27 | 17 | CS | ROTARY / ENCODER | 26 | 5 | 25 | 18 | SCK | ENCB | T_CS | 33 | 19 | ENCA | MISO | T_IRQ | 32 | 21 | SDA | EBUT | 34 | RX | VCC | VN | TX | GND | ILI9341 2.8" Phat-Stats / Interface PCB ESP v1.00 | VP | 22 | SCL | RESET | 23 | MOSI | 3V | GND | SD Slot | QD-TFT2803 - 0.40P | - | + | BATT-IN | BATT OFF/ON | 3.3 | VCC | GND | CS | RST | D/C | MOSI | SCK | BL | MISO | TCLK | TCS | TDIN | TDO | TIRQ | DIN | IRQ | CLK | TCS | DO | V+ | G- | CS | RS | DC | MO | SC | BL | MI
bPlace: VCC | SDA | GND | SCL | BAT | i2c COMS | GND | USB | 15 | RST | DW01 BMS | EN | NEO | 2 | 13 | 0 | IR | ENC_BUT | 12 | BL | 4 | 14 | ENC_A | 16 | D/C | 27 | ENC_B | ILI9341 2.8" Phat-Stats / Interface PCB ESP v1.00 | CS | 17 | ROTARY / ENCODER | 26 | 5 | LED | ENCB | SCK | 18 | 25 | MISO | 33 | 19 | EBUT | ENCA | BATTMON | SDA | 21 | 32 | 34 | RX | VCC | GND | VN | TX | VP | SCL | 22 | RESET | MOSI | 23 | 3V | GND | TOUCH IC | Rupert Hirst 2021 | BL PWM | - | + | 3.3 | VCC | GND | CS | RST | D/C | MOSI | SCK | BL | MISO | TCLK | TCS | TDIN | TDO | TIRQ